# EAGLE design Micro_Bit_Controller_Bit (EAGLE 9.5.2)
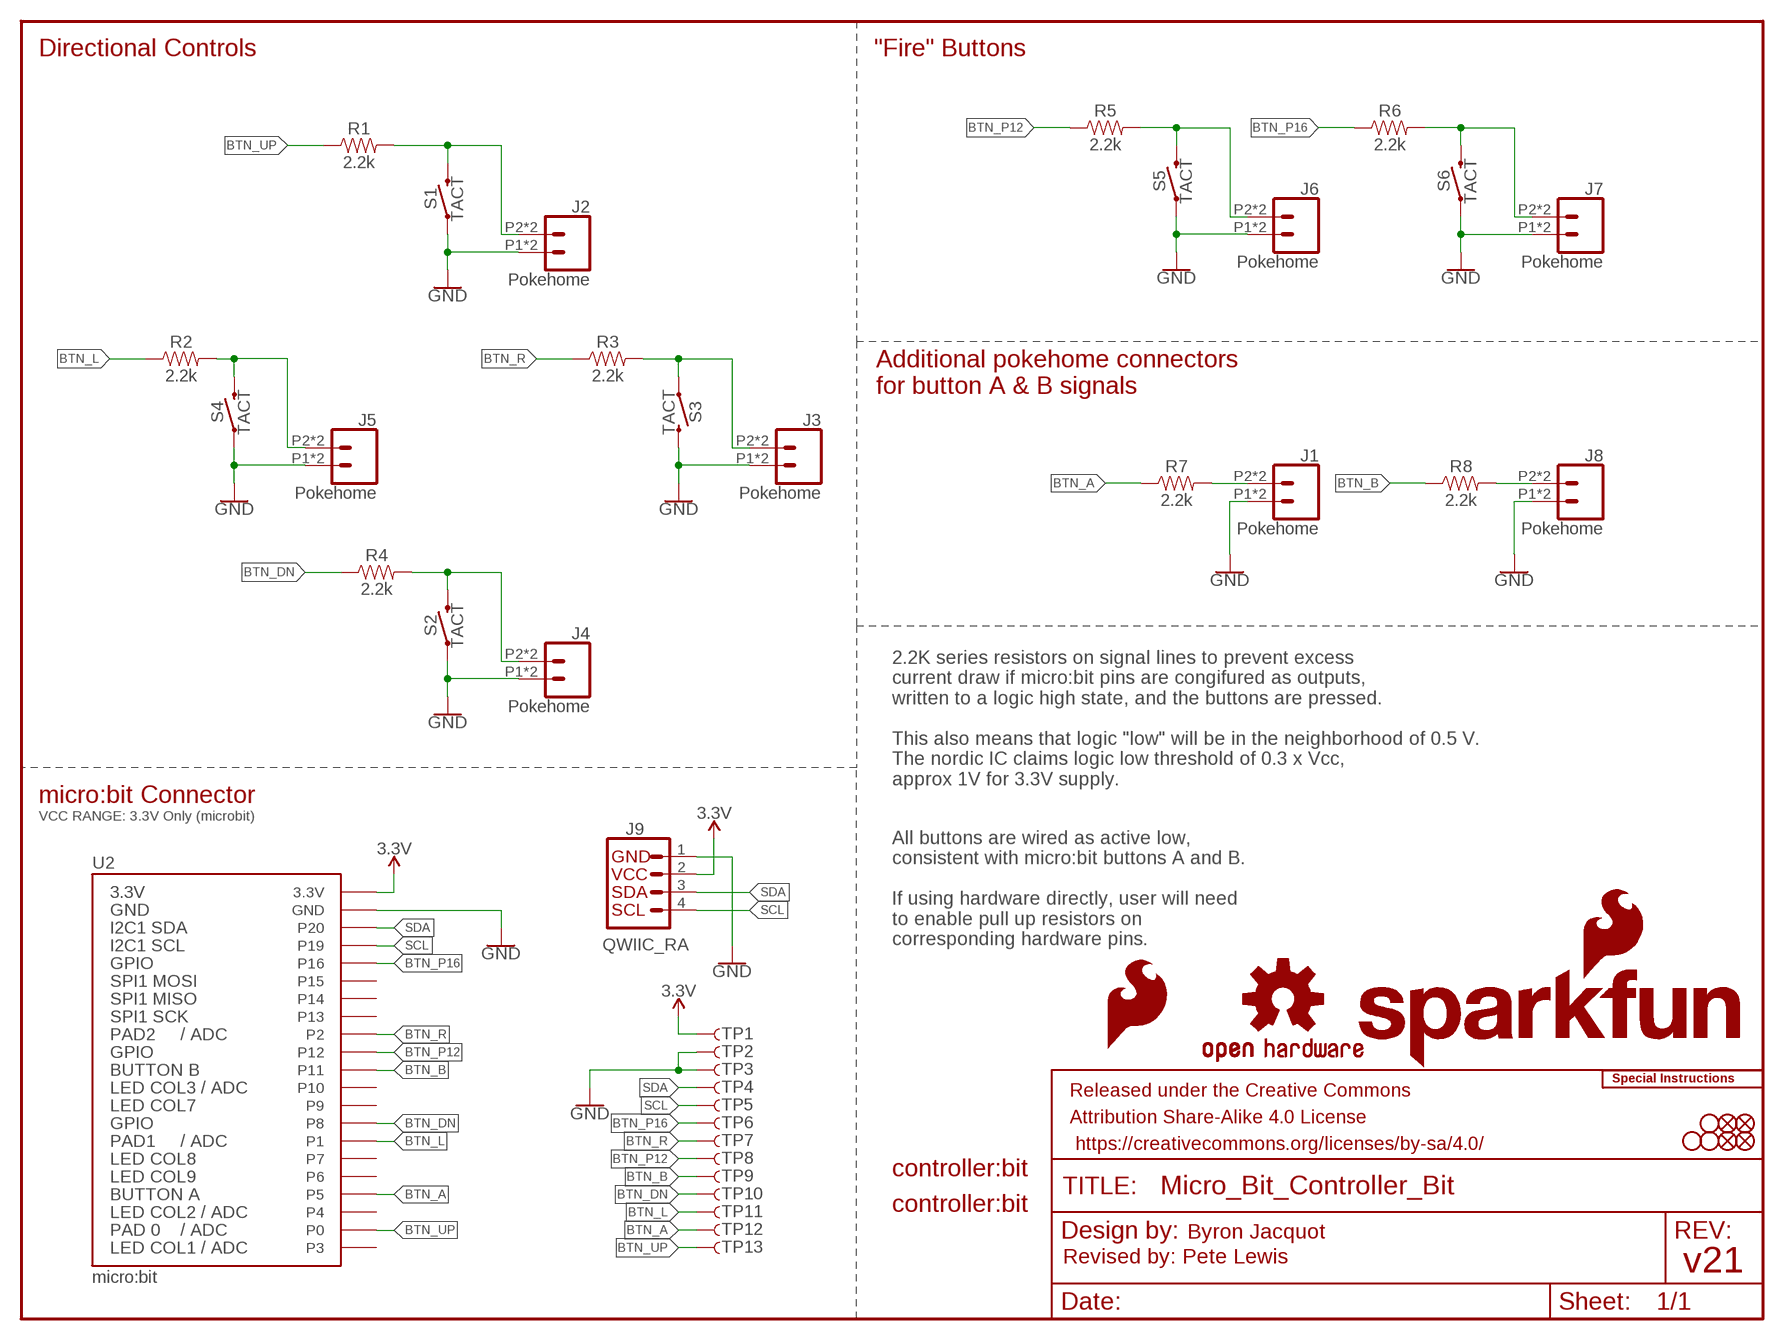
[diagram p0: schematic, sheet 1]

## Parts
FD1  FIDUCIALUFIDUCIAL  [FIDUCIAL-MICRO]
FD2  FIDUCIALUFIDUCIAL  [FIDUCIAL-MICRO]
FD3  FIDUCIALUFIDUCIAL  [FIDUCIAL-MICRO]
FD4  FIDUCIALUFIDUCIAL  [FIDUCIAL-MICRO]
FRAME1  FRAME-LETTER  [CREATIVE_COMMONS]
H1  STAND-OFF  [STAND-OFF]
H2  STAND-OFF  [STAND-OFF]
H3  STAND-OFF  [STAND-OFF]
J1  Pokehome  CONN_02SMALL_POKEHOME  [1X02_POKEHOME]
J2  Pokehome  CONN_02SMALL_POKEHOME  [1X02_POKEHOME]
J3  Pokehome  CONN_02SMALL_POKEHOME  [1X02_POKEHOME]
J4  Pokehome  CONN_02SMALL_POKEHOME  [1X02_POKEHOME]
J5  Pokehome  CONN_02SMALL_POKEHOME  [1X02_POKEHOME]
J6  Pokehome  CONN_02SMALL_POKEHOME  [1X02_POKEHOME]
J7  Pokehome  CONN_02SMALL_POKEHOME  [1X02_POKEHOME]
J8  Pokehome  CONN_02SMALL_POKEHOME  [1X02_POKEHOME]
J9  QWIIC_RA  QWIIC_CONNECTORJS-1MM  [JST04_1MM_RA]
LOGO1  SFE_LOGO_FLAME.2_INCH  [SFE_LOGO_FLAME_.2]
LOGO2  OSHW-LOGOL  [OSHW-LOGO-L]
LOGO3  SFE_LOGO_NAME_FLAME.3_INCH  [SFE_LOGO_NAME_FLAME_.3]
R1  2.2k  2.2KOHM-0603-1/10W-1%  [0603]
R2  2.2k  2.2KOHM-0603-1/10W-1%  [0603]
R3  2.2k  2.2KOHM-0603-1/10W-1%  [0603]
R4  2.2k  2.2KOHM-0603-1/10W-1%  [0603]
R5  2.2k  2.2KOHM-0603-1/10W-1%  [0603]
R6  2.2k  2.2KOHM-0603-1/10W-1%  [0603]
R7  2.2k  2.2KOHM-0603-1/10W-1%  [0603]
R8  2.2k  2.2KOHM-0603-1/10W-1%  [0603]
S1  TACT  MOMENTARY-SWITCH-SPST-SMD-12MM  [TACTILE_SWITCH_SMD_12MM]
S2  TACT  MOMENTARY-SWITCH-SPST-SMD-12MM  [TACTILE_SWITCH_SMD_12MM]
S3  TACT  MOMENTARY-SWITCH-SPST-SMD-12MM  [TACTILE_SWITCH_SMD_12MM]
S4  TACT  MOMENTARY-SWITCH-SPST-SMD-12MM  [TACTILE_SWITCH_SMD_12MM]
S5  TACT  MOMENTARY-SWITCH-SPST-SMD-12MM  [TACTILE_SWITCH_SMD_12MM]
S6  TACT  MOMENTARY-SWITCH-SPST-SMD-12MM  [TACTILE_SWITCH_SMD_12MM]
TP1  TEST-POINT3X5  [PAD.03X.05]
TP2  TEST-POINT3X5  [PAD.03X.05]
TP3  TEST-POINT3X5  [PAD.03X.05]
TP4  TEST-POINT3X5  [PAD.03X.05]
TP5  TEST-POINT3X5  [PAD.03X.05]
TP6  TEST-POINT3X5  [PAD.03X.05]
TP7  TEST-POINT3X5  [PAD.03X.05]
TP8  TEST-POINT3X5  [PAD.03X.05]
TP9  TEST-POINT3X5  [PAD.03X.05]
TP10  TEST-POINT3X5  [PAD.03X.05]
TP11  TEST-POINT3X5  [PAD.03X.05]
TP12  TEST-POINT3X5  [PAD.03X.05]
TP13  TEST-POINT3X5  [PAD.03X.05]
U2  micro:bit  MICRO:BIT_RA  [MICRO:BIT-RA_SMD]
U$1  SPECIAL_INSTRUCTIONS-ORDERING  [ORDERING_INSTRUCTIONS]
U$3  LOGO-CONTROLLER_BIT  [LOGO-CONTROLLER_BIT]
U$6  LOGO-CONTROLLER_BIT  [LOGO-CONTROLLER_BIT]

## Nets
3.3V: J9.2 TP1.P$1 U2.P$27(3.3V) U2.P$28(3.3V) U2.P$29(3.3V) U2.P$30(3.3V) U2.P$31(3.3V) U2.P$32(3.3V)
BTN_A: R7.1 TP12.P$1 U2.P$7(P5)
BTN_B: R8.1 TP9.P$1 U2.P$17(P11)
BTN_DN: R4.1 TP10.P$1 U2.P$14(P8)
BTN_L: R2.1 TP11.P$1 U2.P$10(P1) U2.P$11(P1) U2.P$12(P1) U2.P$13(P1)
BTN_P12: R5.1 TP8.P$1 U2.P$18(P12)
BTN_P16: R6.1 TP6.P$1 U2.P$26(P16)
BTN_R: R3.1 TP7.P$1 U2.P$19(P2) U2.P$20(P2) U2.P$21(P2) U2.P$22(P2)
BTN_UP: R1.1 TP13.P$1 U2.P$2(P0) U2.P$3(P0) U2.P$4(P0) U2.P$5(P0)
GND: J1.P1 J1.P3 J2.P1 J2.P3 J3.P1 J3.P3 J4.P1 J4.P3 J5.P1 J5.P3 J6.P1 J6.P3 J7.P1 J7.P3 J8.P1 J8.P3 J9.1 S1.1 S2.1 S3.3 S4.1 S5.1 S6.1 TP2.P$1 TP3.P$1 U2.P$35(GND) U2.P$36(GND) U2.P$37(GND) U2.P$38(GND) U2.P$39(GND) U2.P$40(GND)
N$1: J2.P2 J2.P4 R1.2 S1.3
N$2: J5.P2 J5.P4 R2.2 S4.3
N$3: J4.P2 J4.P4 R4.2 S2.3
N$4: J3.P2 J3.P4 R3.2 S3.1
N$5: J7.P2 J7.P4 R6.2 S6.3
N$6: J8.P2 J8.P4 R8.2
N$7: J1.P2 J1.P4 R7.2
N$80: J6.P2 J6.P4 R5.2 S5.3
SCL: J9.4 TP5.P$1 U2.P$33(P19)
SDA: J9.3 TP4.P$1 U2.P$34(P20)
Unconnected: U2.P$1(P3) U2.P$6(P4) U2.P$8(P6) U2.P$9(P7) U2.P$15(P9) U2.P$16(P10) U2.P$23(P13) U2.P$24(P14) U2.P$25(P15)

## Notes on the sheet
- Directional Controls | "Fire" Buttons
- Additional pokehome connectors 
  for button A & B signals
- 2.2K series resistors on signal lines to prevent excess
  current draw if micro:bit pins are congifured as outputs, 
  written to a logic high state, and the buttons are pressed.
  
  This also means that logic "low" will be in the neighborhood of 0.5 V.
  The nordic IC claims logic low threshold of 0.3 x Vcc, 
  approx 1V for 3.3V supply.
- micro:bit Connector
- VCC RANGE: 3.3V Only (microbit)
- All buttons are wired as active low, 
  consistent with micro:bit buttons A and B.
  
  If using hardware directly, user will need 
  to enable pull up resistors on
  corresponding hardware pins.
- Byron Jacquot
- Revised by: Pete Lewis
- v21

## Library data of the parts
FD1-FD4 = SparkFun-Aesthetics:FIDUCIAL: Fiducial Alignment Points Point-of-reference for pick-and-place machines and other optical instruments.
FRAME1 = SparkFun-Aesthetics:FRAME-LETTER: Schematic Frame - Letter Standard 8.5x11 US Letter frame
H1-H3 = SparkFun-Hardware:STAND-OFF: Stand Off Drill holes for mechanically mounting via screws, standoffs, etc. Note: Use the keepout ring to avoid running the screw head into surrounding components. Variant Overviews STAND-OFF - Mechanical footprint for a #4 phillips button head screw. STAND-OFF-TIGHT - Mechanical footprint for a #4 phillips button head screw, Example SparkFun Products Screw - Phillips Head (1/4", 4-40, 10 pack) <https://www.sparkfun.com/products/10453> (PRT-10453) Screw - Phillips Head (1/2", 4-40, 10 pack) <https://www.sparkfun.com/products/10452> (PRT-10452) Screw - Phillips Head (3/4", 4-40, 10 pack) <https://www.sparkfun.com/products/10451> (PRT-10451) Screw - Phillips Head (1", 4-40, 10 pack) <https://www.sparkfun.com/products/10450> (PRT-10450)
J1-J8 = SparkFun-Connectors:CONN_02: Multi connection point. Often used as Generic Header-pin footprint for 0.1 inch spaced/style header connections On any of the 0.1 inch spaced packages, you can populate with these: Break Away Headers - Straight <https://www.sparkfun.com/products/116> (PRT-00116) Break Away Male Headers - Right Angle <https://www.sparkfun.com/products/553> (PRT-00553) Female Headers <https://www.sparkfun.com/products/115> (PRT-00115) Break Away Headers - Machine Pin <https://www.sparkfun.com/products/117> (PRT-00117) Break Away Female Headers - Swiss Machine Pin <https://www.sparkfun.com/products/743> (PRT-00743) For SCREWTERMINALS and SPRING TERMINALS visit here: Screw Terimnals on SparkFun.com <https://www.sparkfun.com/search/results?term=Screw+Terminals> (5mm/3.5mm/2.54mm spacing) This device is also useful as a general connection point to wire up your design to another part of your project. Our various solder wires solder well into these plated through hole pads. Hook-Up Wire - Assortment (Stranded, 22 AWG) <https://www.sparkfun.com/products/11375> (PRT-11375) Hook-Up Wire - Assortment (Solid Core, 22 AWG) <https://www.sparkfun.com/products/11367> (PRT-11367) View the entire wire category on our website here <https://www.sparkfun.com/categories/141> Special notes: Molex polarized connector foot print use with: PRT-08233 with associated crimp pins and housings. 2.54_SCREWTERM for use with PRT-10571. 3.5mm Screw Terminal footprints for PRT-08084 5mm Screw Terminal footprints for use with PRT-08432; PROD_ID: CONN-13512
J9 = SparkFun-Connectors:QWIIC_CONNECTOR: SparkFun I2C Standard Qwiic Connector An SMD 1mm pitch JST connector makes it easy and quick (get it? Qwiic?) to connect I2C devices to each other. The Qwiic system <http://www.sparkfun.com/qwiic> enables fast and solderless connection between popular platforms and various sensors and actuators. We carry 200mm <https://www.sparkfun.com/products/14204>, 100mm <https://www.sparkfun.com/products/14205>, 50mm <https://www.sparkfun.com/products/14206>, and breadboard friendly <https://www.sparkfun.com/products/14207> Qwiic cables. We also offer 10 pcs strips <https://www.sparkfun.com/products/14323> the SMD connectors.; PROD_ID: CONN-13694; VALUE: QWIIC_RIGHT_ANGLE
LOGO1 = SparkFun-Aesthetics:SFE_LOGO_FLAME: SparkFun Flame Logo This is the SparkFun flame logo. The logo on the schematic will always be the same size; the package variant is the height of the flame. Default layer for the logo on the board is tSilk.
LOGO2 = SparkFun-Aesthetics:OSHW-LOGO: Open-Source Hardware (OSHW) Logo This logo indicates the piece of hardware it is found on incorporates a OSHW license and/or adheres to the definition of open source hardware found here: http://freedomdefined.org/OSHW
LOGO3 = SparkFun-Aesthetics:SFE_LOGO_NAME_FLAME: SparkFun Font Logo w/ Flame This is the SparkFun full logo. The logo on the schematic will always be the same size; the package variant is the height of the flame part of the logo. Default layer for the logo on the board is tSilk.
R1-R8 = SparkFun-Resistors:2.2KOHM: 2.2kΩ resistor A resistor is a passive two-terminal electrical component that implements electrical resistance as a circuit element. Resistors act to reduce current flow, and, at the same time, act to lower voltage levels within circuits. - Wikipedia; PROD_ID: RES-08272
S1-S6 = SparkFun-Switches:MOMENTARY-SWITCH-SPST: Momentary Switch (Pushbutton) - SPST Normally-open (NO) SPST momentary switches (buttons, pushbuttons). Variants PTH-12MM - 12mm square, through-hole Momentary Pushbutton Switch - 12mm Square <https://www.sparkfun.com/products/9190> (COM-09190) PTH-6.0MM, PTH-6.0MM-KIT - 6.0mm square, through-hole Mini Pushbutton Switch <https://www.sparkfun.com/products/97> (COM-00097) KIT package intended for soldering kit's - only one side of pads' copper is exposed. PTH-RIGHT-ANGLE-KIT - Right-angle, through-hole Right Angle Tactile Button <https://www.sparkfun.com/products/10791> - Used on SparkFun BigTime Watch Kit <https://www.sparkfun.com/products/11734> SMD-12MM - 12mm square, surface-mount Tactile Button - SMD (12mm) <https://www.sparkfun.com/products/12993> (COM-12993) Used on SparkFun PicoBoard <https://www.sparkfun.com/products/11888> SMD-4.5MM - 4.5mm Square Trackball Switch Used on SparkFun Blackberry Trackballer Breakout <https://www.sparkfun.com/products/13169> SMD-4.6MMX2.8MM - 4.60mm x 2.80mm, surface mount Used on SparkFun SAMD21 Mini Breakout <https://www.sparkfun.com/products/13664> SMD-5.2MM, SMD-5.2-REDUNDANT - 5.2mm square, surface-mount Mini Pushbutton Switch - SMD <https://www.sparkfun.com/products/8720> (COM-08720) Used on Arduino Pro Mini <https://www.sparkfun.com/products/11114> REDUNDANT package connects both switch circuits together SMD-6.0X3.5MM - 6.0 x 3.5mm, surface mount Momentary Reset Switch SMD <https://www.sparkfun.com/products/8229> (COM-08229) SMD-6.2MM-TALL - 6.2mm square, surface mount Tactile Button - SMD (6mm) <https://www.sparkfun.com/products/12992> Used on SparkFun Digital Sandbox <https://www.sparkfun.com/products/12651> SMD-RIGHT-ANGLE - Right-angle, surface mount Used on SparkFun Block for Intel® Edison - Arduino <https://www.sparkfun.com/products/13036>; PROD_ID: SWCH-11967; SF_SKU: COM-12993
TP1-TP13 = SparkFun-Connectors:TEST-POINT: SparkFun Test Points Bare copper test points for troubleshooting or In-Circuit-Testing. These are used by our Production team for verifying production board runs using pogo-pins on test beds. SparkFun Products: SparkFun LSM9DS1 Breakout <https://www.sparkfun.com/products/13284> SparkFun PSOC <https://www.sparkfun.com/products/13714> SparkFun Load Cell Amplifier <https://www.sparkfun.com/products/13879>
U2 = SparkFun-Connectors:MICRO:BIT*?; PROD_ID: CONN-14679
U$1 = SparkFun-Aesthetics:SPECIAL_INSTRUCTIONS: Special Ordering/Production Instructions Alert Symbol for special PCB ordering instructions or unique production process warnings. Ordering Instructions Production Instructions Types of information that should be added to box: Copper weight Soldermask color Silk color PCB thickness Number of layers PCB Standard: 1.6mm FR4 1 oz copper immersion silver plating red soldermask white silkscreen Types of information that should be added to box: Special wash requirements Depaneling instructions Humidification Glue curing Default text settings: 0.07 inch 9% ratio 50% line distance
U$3 U$6 = SparkFun-Aesthetics:LOGO-CONTROLLER_BIT

## Board
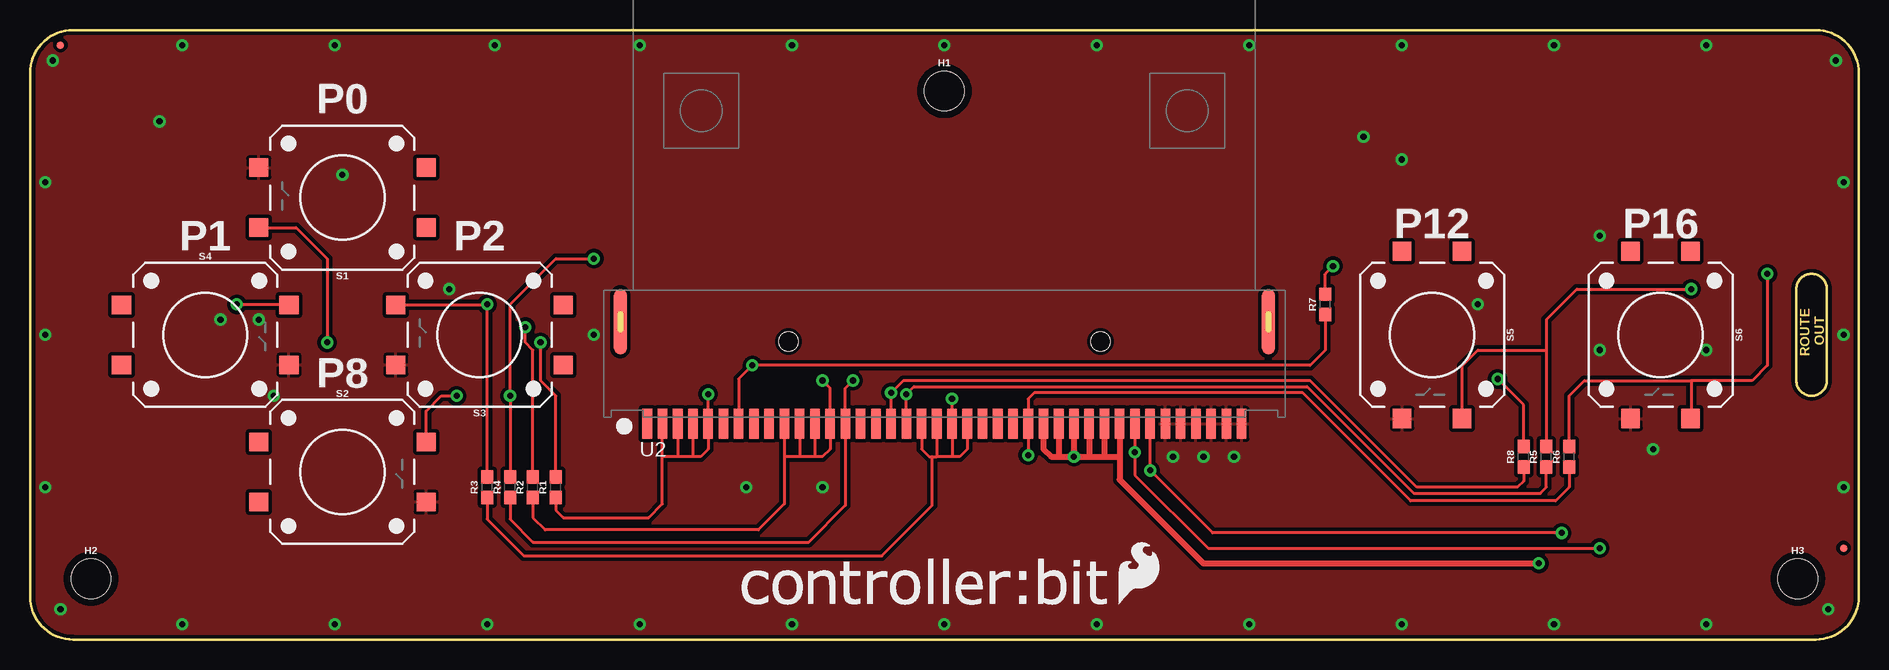
[diagram p1: board, top side]
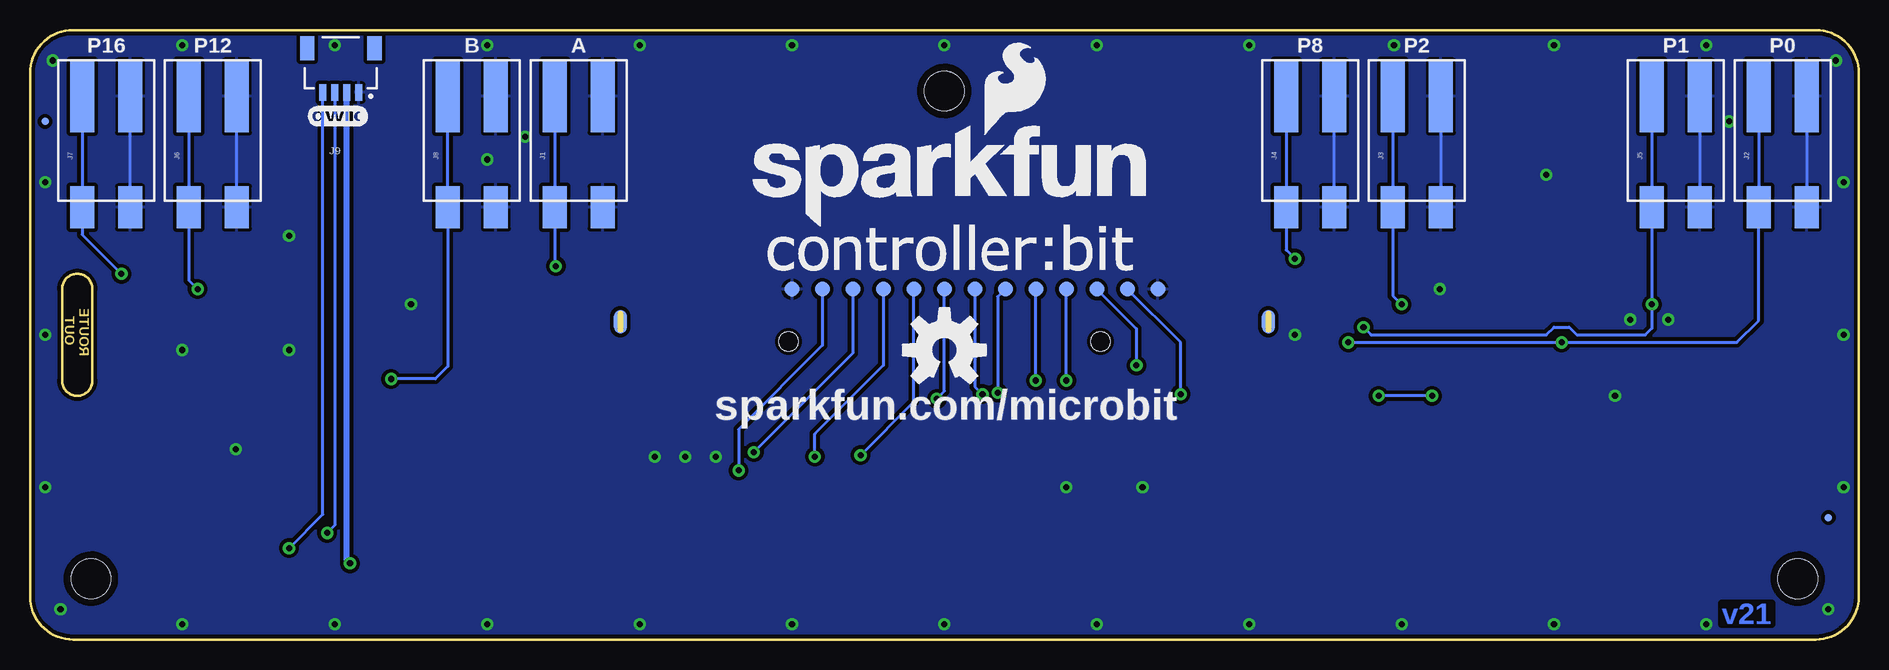
[diagram p2: board, bottom side, seen from below]

Size 152.4 x 50.8 mm. Coordinates in mm from the lower left corner, seen from the top.
Outline: 148.81,50.8 3.59,50.8 arc90 0,47.21 0,3.59 arc90 3.59,0 148.81,0 arc90 152.4,3.59 152.4,47.21 arc90 148.81,50.8
Outline: 149.73,29.21 149.73,21.59 arc-90 148.46,20.32 arc-90 147.19,21.59 147.19,29.21 arc-90 148.46,30.48 arc-90 149.73,29.21
Copper layers (1*16): Top 0.035mm / dielectric 1.5mm / Bottom 0.035mm
Design rules "SparkFun-2-layer-STANDARD": minimum track width 10mil, minimum drill 20mil, track to track 10mil, track to pad 8mil, pad to pad 8mil, via to via 10mil, smd to smd 8mil, copper to edge 8mil, drill to drill 8mil, minimum pad ring 10mil, minimum via ring 10mil, stop-mask expansion 4mil, vias tented up to drill 25mil, thermal gap 10mil

### Footprints (pad centres in the part's own frame; a part is rotated, then mirrored left to right if it is on the bottom)
FIDUCIAL-MICRO = smd 0.635 x 0.635: 1 0,0
STAND-OFF = hole 3.302: 0,0
1X02_POKEHOME = smd 3.5 x 2: P1 5.25,2; P2 5.25,-2 | smd 6 x 2: P3 -4,2; P4 -4,-2
JST04_1MM_RA = smd 0.6 x 1.35: 1 -1.5,0; 2 -0.5,0; 3 0.5,0; 4 1.5,0 | smd 1.2 x 2: NC1 2.8,-3.675; NC2 -2.8,-3.675
0603 = smd 1.1 x 1: 1 -0.85,0; 2 0.85,0
TACTILE_SWITCH_SMD_12MM = smd 1.6 x 1.55: 1 6.975,-2.5; 2 -6.975,-2.5; 3 6.975,2.5; 4 -6.975,2.5
PAD.03X.05 = smd 1.27 x 1.27: P$1 0,0
MICRO:BIT-RA_SMD = smd 0.8 x 2.5: P$1 -24.765,-6.15; P$2 -23.495,-6.15; P$3 -22.225,-6.15; P$4 -20.955,-6.15; P$5 -19.685,-6.15; P$6 -18.415,-6.15; P$7 -17.145,-6.15; P$8 -15.875,-6.15; P$9 -14.605,-6.15; P$10 -13.335,-6.15; P$11 -12.065,-6.15; P$12 -10.795,-6.15; P$13 -9.525,-6.15; P$14 -8.255,-6.15; P$15 -6.985,-6.15; P$16 -5.715,-6.15; P$17 -4.445,-6.15; P$18 -3.175,-6.15; P$19 -1.905,-6.15; P$20 -0.635,-6.15; P$21 0.635,-6.15; P$22 1.905,-6.15; P$23 3.175,-6.15; P$24 4.445,-6.15; P$25 5.715,-6.15; P$26 6.985,-6.15; P$27 8.255,-6.15; P$28 9.525,-6.15; P$29 10.795,-6.15; P$30 12.065,-6.15; P$31 13.335,-6.15; P$32 14.605,-6.15; P$33 15.875,-6.15; P$34 17.145,-6.15; P$35 18.415,-6.15; P$36 19.685,-6.15; P$37 20.955,-6.15; P$38 22.225,-6.15; P$39 23.495,-6.15; P$40 24.765,-6.15 | smd 1.1 x 5.5: P$42 -27,2.36; P$43 27,2.36 | smd 1.1 x 2 bottom: P$44 -27,2.36; P$45 27,2.36 | hole 1.6: 13,0.7; -13,0.7

### Placement (x,y rotation side)
FD1  2.54,49.53 0 top
FD2  151.13,7.62 0 top
FD3  2.54,10.16 0 bottom
FD4  151.13,43.18 0 bottom
FRAME1  32.38,-19.68 0 top  (outside the outline)
H1  76.2,45.72 0 top
H2  5.08,5.08 0 top
H3  147.32,5.08 0 top
J1  106.68,41.27 270 bottom
J2  6.35,41.27 270 bottom
J3  36.83,41.27 270 bottom
J4  45.72,41.27 270 bottom
J5  15.24,41.27 270 bottom
J6  137.16,41.27 270 bottom
J7  146.05,41.27 270 bottom
J8  115.57,41.27 270 bottom
J9  126.49,45.59 180 bottom
LOGO1  90.39,2.73 0 top
LOGO2  76.2,24.13 0 bottom
LOGO3  92.71,34.29 0 bottom
R1  43.81,12.7 90 top
R2  41.91,12.7 90 top
R3  38.1,12.7 90 top
R4  40.01,12.7 90 top
R5  126.36,15.24 90 top
R6  128.27,15.24 90 top
R7  107.95,27.94 90 top
R8  124.46,15.24 90 top
S1  26.04,36.83 180 top
S2  26.04,13.97 0 top
S3  37.47,25.4 180 top
S4  14.61,25.4 0 top
S5  116.84,25.4 270 top
S6  135.89,25.4 270 top
TP1  81.28,29.21 90 bottom
TP2  88.9,29.21 90 bottom
TP3  58.42,29.21 90 bottom
TP4  86.36,29.21 90 bottom
TP5  83.82,29.21 90 bottom
TP6  78.74,29.21 90 bottom
TP7  76.2,29.21 90 bottom
TP8  73.66,29.21 90 bottom
TP9  71.12,29.21 90 bottom
TP10  68.58,29.21 90 bottom
TP11  66.04,29.21 90 bottom
TP12  63.5,29.21 90 bottom
TP13  60.96,29.21 90 bottom
U2  76.2,24.13 0 top
U$1  20.95,-25.4 0 top  (outside the outline)
U$2  [QWIIC_5MM]  126.77,43.64 0 bottom
U$3  59.18,2.92 0 top
U$6  91.06,30.73 0 bottom

### Tracks (layer width: path | path; a pad name or v marks a point on that pad's centre or on a via)
3.3V  (via drill 0.51)
  Top 0.508: U2.P$32 90.81,15.24 | 90.81,15.24 90.81,13.34 97.79,6.35 v125.73,6.35 | U2.P$27 84.45,15.88 85.09,15.24 85.72,15.24 | 85.72,15.24 v87,15.24 | v87,15.24 88.27,15.24 | 88.27,15.24 89.53,15.24 | 89.53,15.24 90.81,15.24 | U2.P$28 85.72,15.24 | U2.P$29 v87,15.24 | U2.P$30 88.27,15.24 | U2.P$31 89.53,15.24
  Bottom 0.254: v87,15.24 87,17.14 81.28,22.86 TP1.P$1
  Bottom 0.508: v125.73,6.35 125.99,6.61 J9.2
BTN_A  (via drill 0.51)
  Top 0.254: R7.1 107.95,24.13 106.68,22.86 v60.2,22.86 59.05,21.72 U2.P$7
  Bottom 0.254: TP12.P$1 60.2,25.91 v60.2,22.86
BTN_B  (via drill 0.51)
  Top 0.254: R8.1 124.46,13.21 123.95,12.7 115.57,12.7 106.68,21.59 72.77,21.59 v71.75,20.57 U2.P$17
  Bottom 0.254: TP9.P$1 71.75,28.57 v71.75,20.57
BTN_DN  (via drill 0.51)
  Top 0.254: R4.1 40.01,10.03 41.91,8.13 64.9,8.13 67.94,11.18 U2.P$14 67.94,20.95 v68.58,21.59
  Bottom 0.254: v68.58,21.59 TP10.P$1
BTN_L  (via drill 0.51)
  Top 0.254: R2.1 41.91,10.16 42.93,9.14 60.71,9.14 62.87,11.3 62.87,15.24 | U2.P$10 62.87,15.24 | 65.41,15.24 66.04,15.24 66.67,15.88 U2.P$13 66.67,20.95 v66.04,21.59 | 65.41,15.24 64.14,15.24 | 64.14,15.24 62.87,15.24 | U2.P$11 64.14,15.24 | U2.P$12 65.41,15.24
  Bottom 0.254: v66.04,21.59 TP11.P$1
BTN_P12  (via drill 0.51)
  Top 0.254: U2.P$18 v73.03,20.45 73.66,21.08 106.43,21.08 115.32,12.19 125.86,12.19 126.36,12.7 R5.1
  Bottom 0.254: TP8.P$1 73.66,21.08 v73.03,20.45
BTN_P16  (via drill 0.51)
  Top 0.254: R6.1 128.27,12.7 127.13,11.56 115.06,11.56 106.05,20.57 83.69,20.57 83.19,20.07 U2.P$26 v83.19,15.37
  Bottom 0.254: v83.19,15.37 78.74,19.81 TP6.P$1
BTN_R  (via drill 0.51)
  Top 0.254: R3.1 38.1,10.03 41.15,6.99 70.99,6.99 75.18,11.18 75.18,15.24 | U2.P$20 75.56,15.24 | U2.P$19 74.3,15.88 74.93,15.24 75.18,15.24 | 75.18,15.24 75.56,15.24 | U2.P$22 78.11,15.88 77.47,15.24 76.83,15.24 | 76.83,15.24 75.56,15.24 | 76.83,15.24 U2.P$21 v76.83,20.07
  Bottom 0.254: v76.83,20.07 76.2,20.7 TP7.P$1
BTN_UP  (via drill 0.51)
  Top 0.254: R1.1 43.81,10.79 44.45,10.16 51.56,10.16 52.7,11.3 52.7,15.24 | 52.7,15.24 U2.P$2 | 55.24,15.24 55.88,15.24 56.52,15.88 U2.P$5 v56.52,20.45 | 55.24,15.24 53.98,15.24 | 53.98,15.24 52.7,15.24 | U2.P$3 53.98,15.24 | U2.P$4 55.24,15.24
  Bottom 0.254: v56.52,20.45 56.52,24.77 TP13.P$1
GND  (via drill 0.51)
  Bottom 0.254: J2.P3 J2.P1 | J3.P3 J3.P1 | J5.P3 J5.P1 | J4.P1 J4.P3 | J6.P1 J6.P3 | J7.P1 J7.P3
  other vias: 2.54,2.54 12.7,1.27 25.4,1.27 38.1,1.27 50.8,1.27 63.5,1.27 76.2,1.27 88.9,1.27 101.6,1.27 114.3,1.27 127,1.27 139.7,1.27 149.86,2.54 150.5,48.26 139.7,49.53 127,49.53 114.3,49.53 101.6,49.53 88.9,49.53 76.2,49.53 63.5,49.53 50.8,49.53 38.73,49.53 25.4,49.53 12.7,49.53 1.91,48.26 1.27,12.7 1.27,25.4 1.27,38.1 151.13,12.7 151.13,25.4 151.13,38.1 100.33,15.24 97.79,15.24 26.04,38.73 20.32,20.32 34.92,29.21 46.99,25.4 135.25,15.88 139.7,24.13 111.12,41.91 130.81,33.66 120.65,27.94 114.3,40.01 15.88,26.67 19.05,26.67 10.79,43.18 130.81,24.13 95.25,15.24 59.69,12.7 66.04,12.7
  pour Top (isolate 0.305, rank 5): 0,50.8 150.6,50.8 arc-90 152.4,49 152.4,0 0,0
  pour Bottom (isolate 0.305, rank 5): 152.4,50.8 1.8,50.8 arc90 0,49 0,0 152.4,0
N$1  (via drill 0.51)
  Top 0.254: R1.2 43.81,20.32 42.55,21.59 v42.55,24.77 | S1.3 22.18,34.33 24.77,31.75 v24.77,24.77
  Bottom 0.254: J2.P4 J2.P2 8.35,26.57 10.16,24.77 v24.77,24.77 v42.55,24.77
N$2  (via drill 0.51)
  Top 0.254: R2.2 41.91,24.13 41.27,24.77 v41.27,26.04 | S4.3 17.28,27.9 v17.24,27.94
  Bottom 0.254: J5.P4 J5.P2 v17.24,27.94 17.24,25.94 17.78,25.4 23.5,25.4 24.13,26.04 25.4,26.04 26.04,25.4 40.64,25.4 v41.27,26.04
N$3  (via drill 0.51)
  Top 0.254: R4.2 v40.01,20.32 40.01,27.94 43.81,31.75 v46.99,31.75 | S2.3 33.01,19.04 34.29,20.32 v35.56,20.32
  Bottom 0.254: J4.P4 J4.P2 47.72,32.48 v46.99,31.75 | v35.56,20.32 v40.01,20.32
N$4  (via drill 0.51)
  Top 0.254: S3.1 38.06,27.9 v38.1,27.94 R3.2
  Bottom 0.254: J3.P4 J3.P2 38.83,28.67 v38.1,27.94
N$5  (via drill 0.51)
  Top 0.254: R6.2 128.27,20.32 129.54,21.59 138.43,21.59 | 138.43,21.59 138.43,18.46 S6.3 | v144.78,30.48 144.78,22.86 143.51,21.59 138.43,21.59
  Bottom 0.254: J7.P4 J7.P2 148.05,33.75 v144.78,30.48
N$6  (via drill 0.51)
  Top 0.254: R8.2 124.46,19.56 v122.3,21.72
  Bottom 0.254: J8.P4 J8.P2 117.57,22.77 118.62,21.72 v122.3,21.72
N$7  (via drill 0.51)
  Top 0.254: R7.2 107.95,30.48 v108.58,31.11
  Bottom 0.254: J1.P4 J1.P2 108.68,31.21 v108.58,31.11
N$80  (via drill 0.51)
  Top 0.254: v138.43,29.21 128.91,29.21 126.36,26.67 126.36,24.13 | 126.36,24.13 R5.2 | S5.3 119.34,22.82 120.65,24.13 126.36,24.13
  Bottom 0.254: J6.P4 J6.P2 139.16,29.94 v138.43,29.21
SCL  (via drill 0.51)
  Top 0.254: U2.P$33 v92.08,15.62 92.08,13.72 98.17,7.62 v130.81,7.62
  Bottom 0.254: v130.81,7.62 127.99,10.44 J9.4 | TP5.P$1 83.82,23.88 v92.08,15.62
SDA  (via drill 0.51)
  Top 0.254: v127.64,8.89 98.55,8.89 v93.34,14.1 U2.P$34
  Bottom 0.254: J9.3 126.99,9.53 v127.64,8.89 | TP4.P$1 86.36,24.51 93.34,17.53 v93.34,14.1

### Text on the board
Bottom: v21
Dimension: ROUTE / OUT
tPlace: P0 | P12 | P16 | P1 | P2 | P8
bPlace: P0 | P1 | P2 | P8 | A | B | P12 | P16 | sparkfun.com/microbit
Measures: All dimensions in inches. | 3x 0.130 diam holes / Clear 4-40 machine screws
tDocu: Byron Jacquot | Revised by: Pete Lewis | 1. Gloss black soldermask